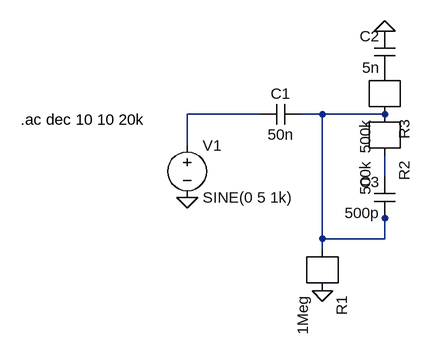
[diagram p0: schematic eq 5f2a.asc]
eq 5f2a.asc, the LTspice schematic file:
Version 4
SHEET 1 880 680
WIRE 352 160 240 160
WIRE 448 160 416 160
WIRE 544 160 448 160
WIRE 240 208 240 160
WIRE 544 256 544 224
WIRE 544 320 544 304
WIRE 448 352 448 160
WIRE 544 352 544 320
WIRE 544 352 448 352
WIRE 448 368 448 352
FLAG 544 32 0
FLAG 448 432 0
FLAG 240 288 0
SYMBOL r 448 368 R90
SYMATTR InstName R1
SYMATTR Value 1Meg
SYMBOL cap 416 144 R90
WINDOW 0 0 32 VBottom 2
WINDOW 3 32 32 VTop 2
SYMATTR InstName C1
SYMATTR Value 50n
SYMBOL voltage 240 192 R0
SYMATTR InstName V1
SYMATTR Value SINE(0 5 1k)
SYMATTR Value2 AC 1k
SYMBOL cap 560 320 R180
WINDOW 0 24 56 Left 2
WINDOW 3 24 8 Left 2
SYMATTR InstName C3
SYMATTR Value 500p
SYMBOL r 544 96 R90
SYMATTR InstName R3
SYMATTR Value 500k
SYMBOL cap 560 96 R180
WINDOW 0 24 56 Left 2
WINDOW 3 24 8 Left 2
SYMATTR InstName C2
SYMATTR Value 5n
SYMBOL r 544 160 R90
SYMATTR InstName R2
SYMATTR Value 500k
TEXT -16 168 Left 2 !.ac dec 10 10 20k

The netlist it stands for:
* eq 5f2a.asc
R1 0 N002 1Meg
C1 N002 N001 50n
V1 N001 0 SINE(0 5 1k) AC 1k
C3 N002 N003 500p
R3 N002 P001 500k
C2 P001 0 5n
R2 N003 N002 500k
.ac dec 10 10 20k
.backanno
.end